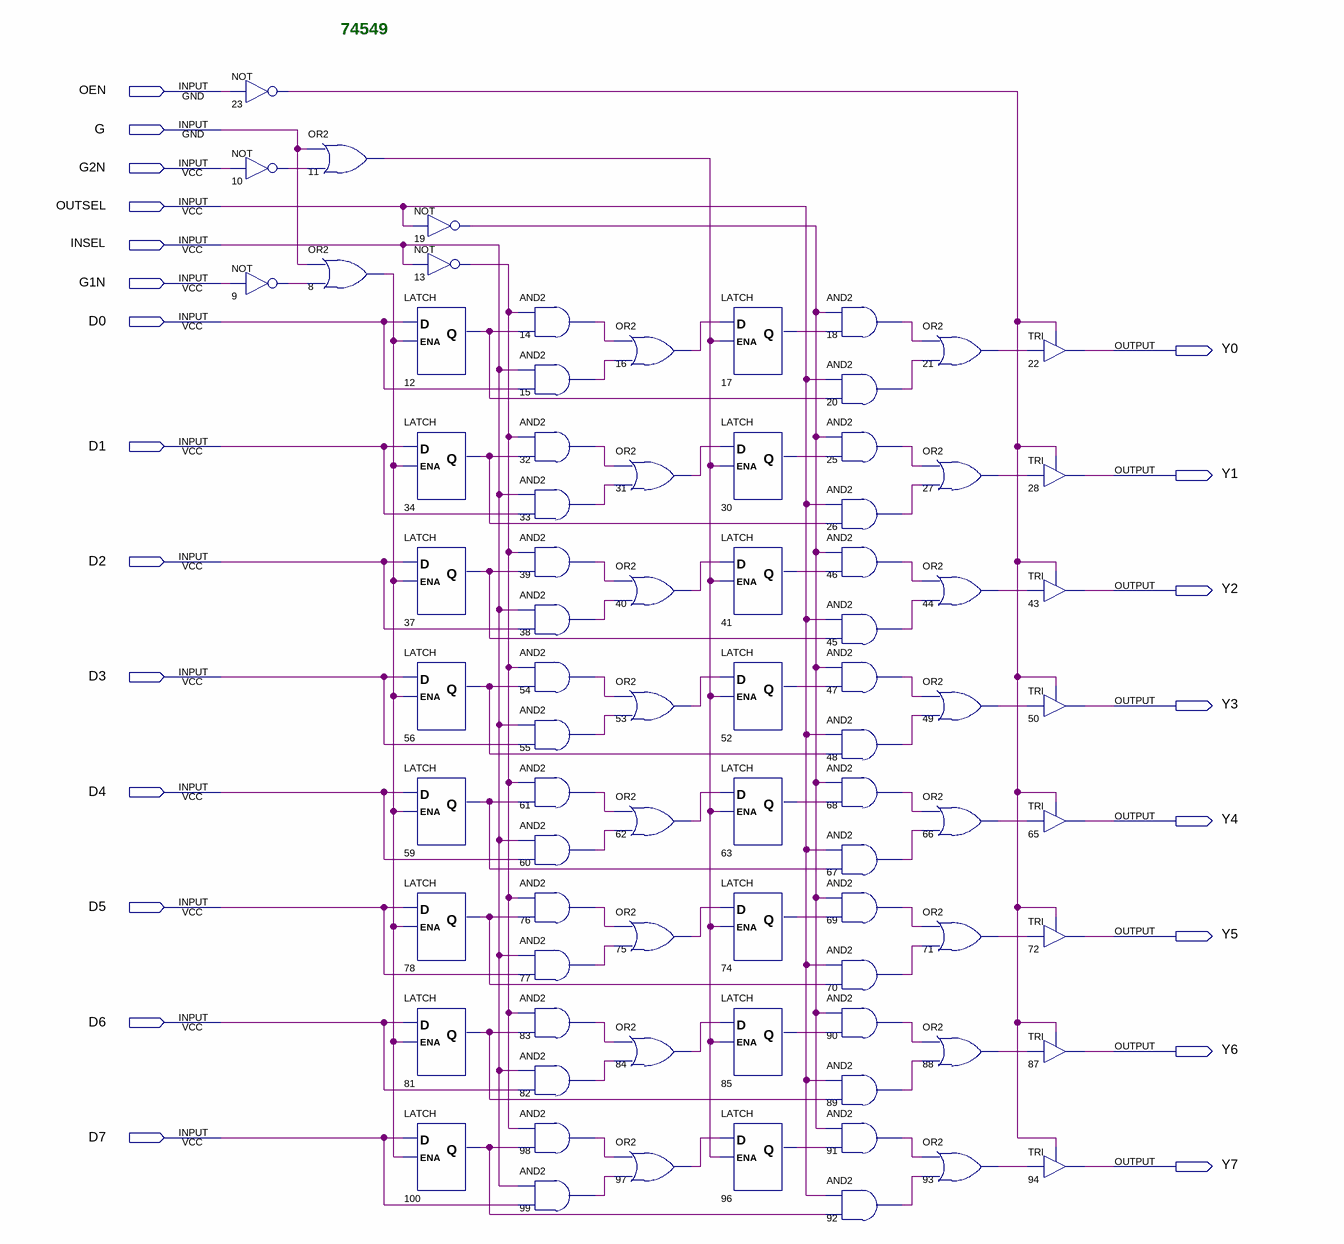
[diagram p0: schematic sheet]
// Quartus schematic 74549.bdf as structural Verilog: 79 symbols, 22 pins
module \74549  (
  input  OEN,
  input  G,
  input  G2N,
  input  OUTSEL,
  input  INSEL,
  input  G1N,
  input  D0,
  input  D1,
  input  D2,
  input  D3,
  input  D4,
  input  D5,
  input  D6,
  input  D7,
  output Y0,
  output Y1,
  output Y2,
  output Y3,
  output Y4,
  output Y5,
  output Y6,
  output Y7
);

  wire n8_out, n9_out, n10_out, n11_out, n12_q, n13_out, n14_out, n15_out, n16_out, n17_q, n18_out, n19_out,
       n20_out, n21_out, n23_out, n25_out, n26_out, n27_out, n30_q, n31_out, n32_out, n33_out, n34_q, n37_q,
       n38_out, n39_out, n40_out, n41_q, n44_out, n45_out, n46_out, n47_out, n48_out, n49_out, n52_q,
       n53_out, n54_out, n55_out, n56_q, n59_q, n60_out, n61_out, n62_out, n63_q, n66_out, n67_out, n68_out,
       n69_out, n70_out, n71_out, n74_q, n75_out, n76_out, n77_out, n78_q, n81_q, n82_out, n83_out, n84_out,
       n85_q, n88_out, n89_out, n90_out, n91_out, n92_out, n93_out, n96_q, n97_out, n98_out, n99_out, n100_q;

  not u_23 (n23_out, OEN);
  not u_10 (n10_out, G2N);
  not u_9 (n9_out, G1N);
  or u_11 (n11_out, G, n10_out);
  or u_8 (n8_out, G, n9_out);
  not u_19 (n19_out, OUTSEL);
  not u_13 (n13_out, INSEL);
  LATCH u_12 (.D(D0), .ENA(n8_out), .Q(n12_q));
  LATCH u_34 (.D(D1), .ENA(n8_out), .Q(n34_q));
  LATCH u_37 (.D(D2), .ENA(n8_out), .Q(n37_q));
  LATCH u_56 (.D(D3), .ENA(n8_out), .Q(n56_q));
  LATCH u_59 (.D(D4), .ENA(n8_out), .Q(n59_q));
  LATCH u_78 (.D(D5), .ENA(n8_out), .Q(n78_q));
  LATCH u_81 (.D(D6), .ENA(n8_out), .Q(n81_q));
  LATCH u_100 (.D(D7), .ENA(n8_out), .Q(n100_q));
  and u_14 (n14_out, n13_out, n12_q);
  and u_15 (n15_out, INSEL, D0);
  and u_32 (n32_out, n13_out, n34_q);
  and u_33 (n33_out, INSEL, D1);
  and u_39 (n39_out, n13_out, n37_q);
  and u_38 (n38_out, INSEL, D2);
  and u_54 (n54_out, n13_out, n56_q);
  and u_55 (n55_out, INSEL, D3);
  and u_61 (n61_out, n13_out, n59_q);
  and u_60 (n60_out, INSEL, D4);
  and u_76 (n76_out, n13_out, n78_q);
  and u_77 (n77_out, INSEL, D5);
  and u_83 (n83_out, n13_out, n81_q);
  and u_82 (n82_out, INSEL, D6);
  and u_98 (n98_out, n13_out, n100_q);
  and u_99 (n99_out, INSEL, D7);
  or u_16 (n16_out, n14_out, n15_out);
  or u_31 (n31_out, n32_out, n33_out);
  or u_40 (n40_out, n39_out, n38_out);
  or u_53 (n53_out, n54_out, n55_out);
  or u_62 (n62_out, n61_out, n60_out);
  or u_75 (n75_out, n76_out, n77_out);
  or u_84 (n84_out, n83_out, n82_out);
  or u_97 (n97_out, n98_out, n99_out);
  LATCH u_17 (.D(n16_out), .ENA(n11_out), .Q(n17_q));
  LATCH u_30 (.D(n31_out), .ENA(n11_out), .Q(n30_q));
  LATCH u_41 (.D(n40_out), .ENA(n11_out), .Q(n41_q));
  LATCH u_52 (.D(n53_out), .ENA(n11_out), .Q(n52_q));
  LATCH u_63 (.D(n62_out), .ENA(n11_out), .Q(n63_q));
  LATCH u_74 (.D(n75_out), .ENA(n11_out), .Q(n74_q));
  LATCH u_85 (.D(n84_out), .ENA(n11_out), .Q(n85_q));
  LATCH u_96 (.D(n97_out), .ENA(n11_out), .Q(n96_q));
  and u_18 (n18_out, n19_out, n17_q);
  and u_20 (n20_out, OUTSEL, n12_q);
  and u_25 (n25_out, n19_out, n30_q);
  and u_26 (n26_out, OUTSEL, n34_q);
  and u_46 (n46_out, n19_out, n41_q);
  and u_45 (n45_out, OUTSEL, n37_q);
  and u_47 (n47_out, n19_out, n52_q);
  and u_48 (n48_out, OUTSEL, n56_q);
  and u_68 (n68_out, n19_out, n63_q);
  and u_67 (n67_out, OUTSEL, n59_q);
  and u_69 (n69_out, n19_out, n74_q);
  and u_70 (n70_out, OUTSEL, n78_q);
  and u_90 (n90_out, n19_out, n85_q);
  and u_89 (n89_out, OUTSEL, n81_q);
  and u_91 (n91_out, n19_out, n96_q);
  and u_92 (n92_out, OUTSEL, n100_q);
  or u_21 (n21_out, n18_out, n20_out);
  or u_27 (n27_out, n25_out, n26_out);
  or u_44 (n44_out, n46_out, n45_out);
  or u_49 (n49_out, n47_out, n48_out);
  or u_66 (n66_out, n68_out, n67_out);
  or u_71 (n71_out, n69_out, n70_out);
  or u_88 (n88_out, n90_out, n89_out);
  or u_93 (n93_out, n91_out, n92_out);
  TRI u_22 (.IN(n21_out), .OE(n23_out), .OUT(Y0));
  TRI u_28 (.IN(n27_out), .OE(n23_out), .OUT(Y1));
  TRI u_43 (.IN(n44_out), .OE(n23_out), .OUT(Y2));
  TRI u_50 (.IN(n49_out), .OE(n23_out), .OUT(Y3));
  TRI u_65 (.IN(n66_out), .OE(n23_out), .OUT(Y4));
  TRI u_72 (.IN(n71_out), .OE(n23_out), .OUT(Y5));
  TRI u_87 (.IN(n88_out), .OE(n23_out), .OUT(Y6));
  TRI u_94 (.IN(n93_out), .OE(n23_out), .OUT(Y7));

  // Notes on the sheet:
  //   74549
endmodule
